# Altium schematic sheet 电路图-ad10.SchDoc
size A4; SheetNumber: 0; SheetTotal: 0
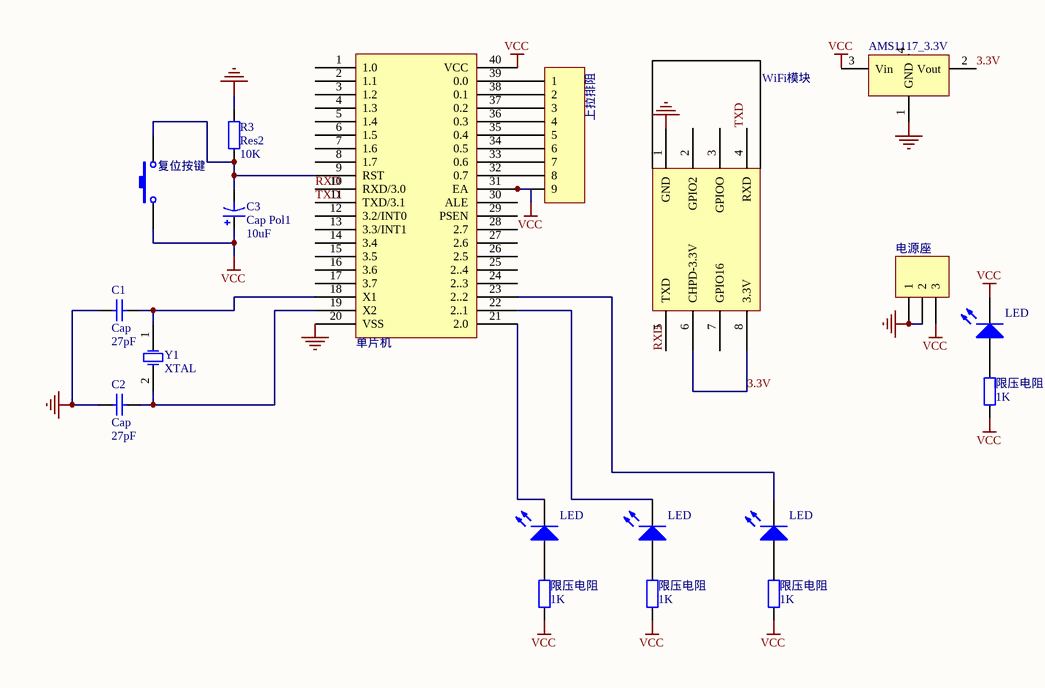
[diagram p0: 电路图-ad10.SchDoc]

## Parts
(Parts that share a designator on the sheet are numbered #1, #2 ... from top to bottom, then left to right.)
*  WiFi模块
AMS1117_3.3V  AMS1117_3.3V  [SOT223]  (value not drawn)
C1  Cap  value 27pF  [RAD-0.3]
C2  Cap  value 27pF  [RAD-0.3]
C3  Cap Pol1  value 10uF  [RB7.6-15]
LED#1  LED0  [LED-0]  (value not drawn)
LED#2  LED0  [LED-0]  (value not drawn)
LED#3  LED0  [LED-0]  (value not drawn)
LED#4  LED0  [LED-0]  (value not drawn)
R3  Res2  value 10K  [AXIAL-0.4]
U1  单片机
Y1  XTAL  [R38]
上拉排阻  Header 9  [HDR1X9]  (value not drawn)
复位按键  SW-PB  [SPST-2]  (value not drawn)
电源座  Header 3  [HDR1X3]  (value not drawn)
限压电阻#1  value 1K  [AXIAL-0.4]  (hidden comment: Res2)
限压电阻#2  value 1K  [AXIAL-0.4]  (hidden comment: Res2)
限压电阻#3  value 1K  [AXIAL-0.4]  (hidden comment: Res2)
限压电阻#4  value 1K  [AXIAL-0.4]  (hidden comment: Res2)

## Nets
GND: *.1(GND) AMS1117_3.3V.1(GND) C1.1 C2.1 R3.2 U1.20(VSS) 电源座.1 电源座.2
VCC: C3.1 LED#1.2(K) U1.31(EA) U1.40(VCC) 上拉排阻.9 复位按键.1 电源座.3 限压电阻#1.1 限压电阻#2.1 限压电阻#3.1 限压电阻#4.1
3.3V: *.6(CHPD-3.3V) *.8(3.3V) AMS1117_3.3V.2(Vout)
RXD: *.5(TXD) U1.10(RXD/3.0)
TXD: *.4(RXD) U1.11(TXD/3.1)
NetC1_2: C1.2 U1.18(X1) Y1.1(OSC1)
NetC2_2: C2.2 U1.19(X2) Y1.2(OSC2)
NetC3_2: C3.2 R3.1 U1.9(RST) 复位按键.2
NetLED#1_1: LED#1.1(A) 限压电阻#1.2
NetLED#2_1: LED#2.1(A) 限压电阻#2.2
NetLED#2_2: LED#2.2(K) U1.21(2.0)
NetLED#3_1: LED#3.1(A) 限压电阻#3.2
NetLED#3_2: LED#3.2(K) U1.22(2..1)
NetLED#4_1: LED#4.1(A) 限压电阻#4.2
NetLED#4_2: LED#4.2(K) U1.23(2..2)
NetU1_32: U1.32(0.7) 上拉排阻.8
NetU1_33: U1.33(0.6) 上拉排阻.7
NetU1_34: U1.34(0.5) 上拉排阻.6
NetU1_35: U1.35(0.4) 上拉排阻.5
NetU1_36: U1.36(0.3) 上拉排阻.4
NetU1_37: U1.37(0.2) 上拉排阻.3
NetU1_38: U1.38(0.1) 上拉排阻.2
NetU1_39: U1.39(0.0) 上拉排阻.1

Not connected (* = marked no-connect by the designer): * 2(GPIO2) 3(GPIOO) 7(GPIO16); AMS1117_3.3V 3(Vin) 4; U1 1(1.0) 2(1.1) 3(1.2) 4(1.3) 5(1.4) 6(1.5) 7(1.6) 8(1.7) 12(3.2/INT0) 13(3.3/INT1) 14(3.4) 15(3.5) 16(3.6) 17(3.7) 24(2..3) 25(2..4) 26(2.5) 27(2.6) 28(2.7) 29(PSEN) 30(ALE)

## Notes on the sheet
- Labels drawn without touching a wire or pin: VCC

## Library data of the parts
* = ESP8266
AMS1117_3.3V = AMS1117_3.3
C1 C2 = Cap: Capacitor; Published: 8-Jun-2000; LatestRevisionDate: 17-Jul-2002; LatestRevisionNote: Re-released for DXP Platform.; PackageReference: RAD-0.3; Publisher: Altium Limited; PackageDescription: Radial Cap, Thru-Hole; 2 Leads; 0.3 in Pin Spacing
C3 = Cap Pol1: Polarized Capacitor (Radial); Published: 8-Jun-2000; LatestRevisionDate: 17-Jul-2002; LatestRevisionNote: Re-released for DXP Platform.; PackageReference: RB7.6-15; Publisher: Altium Limited; PackageDescription: Polarized Capacitor (Radial); 2 Leads
LED#1-LED#4 = LED0: Typical INFRARED GaAs LED; Published: 8-Jun-2000; LatestRevisionDate: 08-Jul-2005; LatestRevisionNote: Mech Layer 1 removed.; PackageReference: LED-0; Publisher: Altium Limited; PackageDescription: LED; 2 Leads
R3 限压电阻#1-限压电阻#4 = Res2: Resistor; Published: 8-Jun-2000; LatestRevisionDate: 17-Jul-2002; LatestRevisionNote: Re-released for DXP Platform.; PackageReference: AXIAL-0.4; Publisher: Altium Limited; PackageDescription: Axial Device, Thru-Hole; 2 Leads; 0.4 in Pin Spacing
U1 = at89c51
Y1 = XTAL: Crystal Oscillator; Published: 8-Jun-2000; LatestRevisionDate: 17-Jul-2002; LatestRevisionNote: Re-released for DXP Platform.; PackageReference: R38; Publisher: Altium Limited; PackageDescription: Crystal, Thru-Hole; 2 Leads; Body 3.1 x 8.2 mm (Dia.xH)
上拉排阻 = Header 9: Header, 9-Pin; LatestRevisionDate: 17-Jul-2002; LatestRevisionNote: Re-released for DXP Platform.; Publisher: Altium Limited
复位按键 = SW-PB: Switch; Published: 24-Mar-1999; LatestRevisionDate: 17-Jul-2002; LatestRevisionNote: Re-released for DXP Platform.; PackageReference: SPST-2; Publisher: Altium Limited; PackageDescription: Switch; 2 Leads
电源座 = Header 3: Header, 3-Pin; LatestRevisionDate: 17-Jul-2002; LatestRevisionNote: Re-released for DXP Platform.; Publisher: Altium Limited